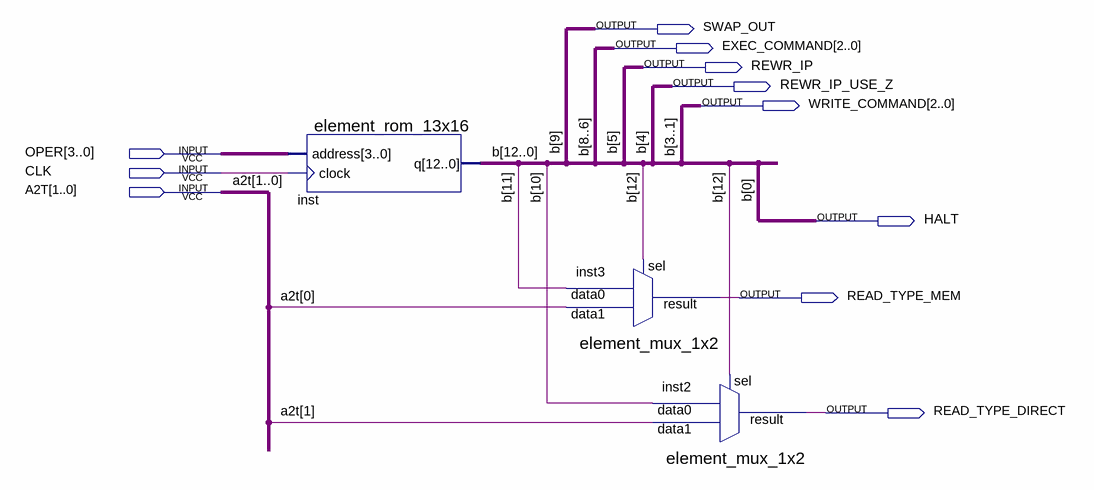
[diagram p0: schematic sheet]
// Quartus schematic block-control-commands.bdf as structural Verilog: 3 symbols, 11 pins
module \block-control-commands  (
  input  [3:0] OPER,
  input  CLK,
  input  [1:0] A2T,
  output SWAP_OUT,
  output [2:0] EXEC_COMMAND,
  output REWR_IP,
  output REWR_IP_USE_Z,
  output [2:0] WRITE_COMMAND,
  output HALT,
  output READ_TYPE_MEM,
  output READ_TYPE_DIRECT
);

  wire [12:10] b;

  element_rom_13x16 inst (
    .address(OPER), .clock(CLK), .q({b, SWAP_OUT, EXEC_COMMAND, REWR_IP, REWR_IP_USE_Z, WRITE_COMMAND, HALT}));
  element_mux_1x2 inst3 (.data1(A2T[0]), .data0(b[11]), .sel(b[12]), .result(READ_TYPE_MEM));
  element_mux_1x2 inst2 (.data1(A2T[1]), .data0(b[10]), .sel(b[12]), .result(READ_TYPE_DIRECT));

  // Other names for the same wires on the sheet: b[9:0] = {SWAP_OUT, EXEC_COMMAND, REWR_IP, REWR_IP_USE_Z, WRITE_COMMAND, HALT}
endmodule
